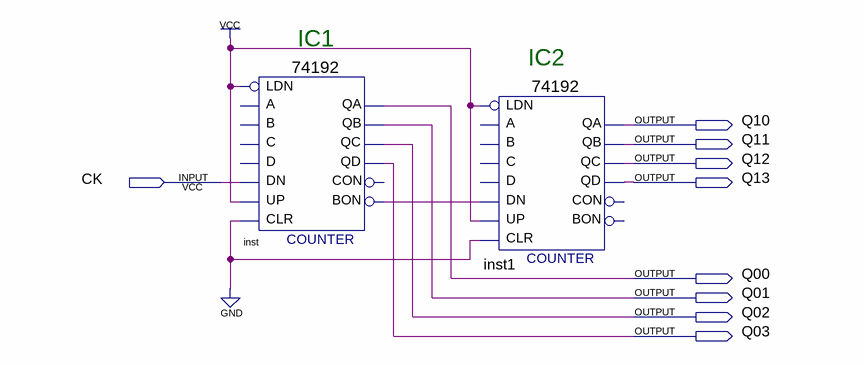
[diagram p0: schematic sheet]
// Quartus schematic 100_MOD_D_74192.bdf as structural Verilog: 2 symbols, 9 pins
module \100_MOD_D_74192  (
  input  CK,
  output Q10,
  output Q11,
  output Q12,
  output Q13,
  output Q00,
  output Q01,
  output Q02,
  output Q03
);

  wire inst_bon;

  \74192  inst (
    .CLR(1'b0), .UP(1'b1), .DN(CK), .LDN(1'b1), .QB(Q01), .BON(inst_bon), .QA(Q00), .QC(Q02), .QD(Q03));  // open: D, C, A, B, CON
  \74192  inst1 (
    .CLR(1'b0), .UP(1'b1), .DN(inst_bon), .LDN(1'b1), .QB(Q11), .QA(Q10), .QC(Q12), .QD(Q13));  // open: D, C, A, B, BON, CON

  // Notes on the sheet:
  //   IC1
  //   IC2
endmodule
